# EAGLE design DIY ESP32 SmartClock Kit with Weather Forecasting V1.1 (EAGLE 6.1)
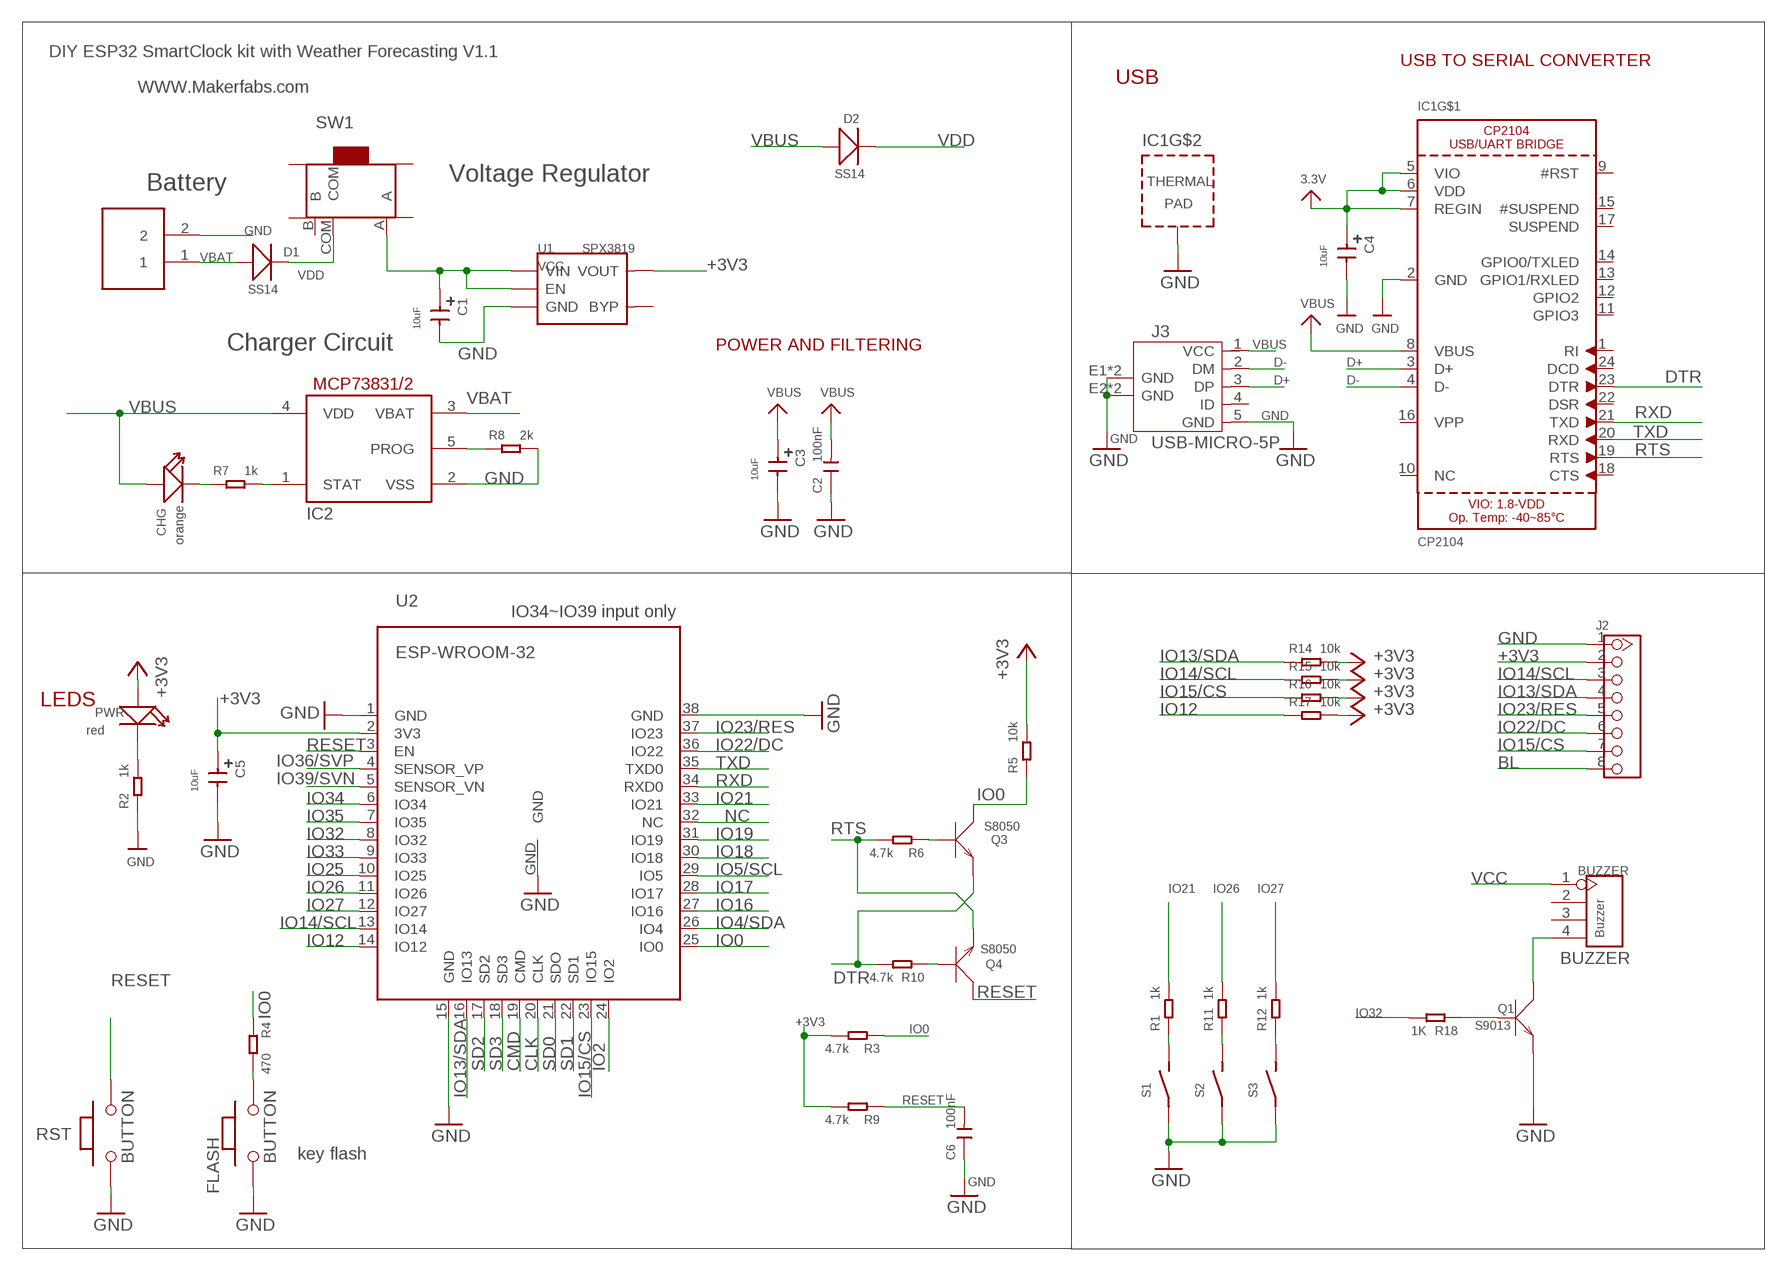
[diagram p0: schematic, sheet 1, part 1 of 2]
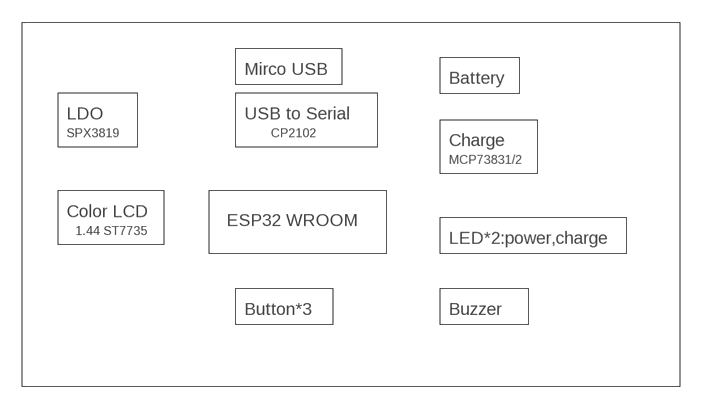
[diagram p1: schematic, sheet 1, part 2 of 2]

## Parts
BUZZER  Buzzer  HEADER-4P-60/35MILROUND  [4P-65/35ROUND]
C1  10uF  C_10U  [CAP_5*7]
C2  100nF  C'5.08'  [CERAMIC-5.08]
C3  10uF  C_10U  [CAP_5*7]
C4  10uF  C_10U  [CAP_5*7]
C5  10uF  C_10U  [CAP_5*7]
C6  100nF  C'5.08'  [CERAMIC-5.08]
CHG  orange  LED'0603'  [LED-0603]
D1  SS14  D'0805'  [SOD323]
D2  SS14  D'0805'  [SOD323]
FLASH  BUTTON  PB157  [157SW]
IC1  CP2104  [QFN24_4MM_SMSC]
IC2  MCP73831/OT  [SOT23-5L]
J1  PH2.0-2P-90-DIP  [PH2.0-2P-90-DIP]
J2  HEADER-8P-2.54  [8P-2.54]
J3  USB-MICRO-5P  [MICRO-USB-5P]
PWR  red  LED'0603'  [LED-0603]
Q1  S9013  TRANSISTOR-NPN-SOT23  [SOT23]
Q3  S8050  TRANSISTOR-NPN-SOT23  [SOT23]
Q4  S8050  TRANSISTOR-NPN-SOT23  [SOT23]
R1  1k  R-0204/7  [0204/7]
R2  1k  R-0204/7  [0204/7]
R3  4.7k  R-0204/7  [0204/7]
R4  470  R-0204/7  [0204/7]
R5  10k  R-0204/7  [0204/7]
R6  4.7k  R-0204/7  [0204/7]
R7  1k  R-0204/7  [0204/7]
R8  2k  R-0204/7  [0204/7]
R9  4.7k  R-0204/7  [0204/7]
R10  4.7k  R-0204/7  [0204/7]
R11  1k  R-0204/7  [0204/7]
R12  1k  R-0204/7  [0204/7]
R14  10k  R-0204/7  [0204/7]
R15  10k  R-0204/7  [0204/7]
R16  10k  R-0204/7  [0204/7]
R17  10k  R-0204/7  [0204/7]
R18  1K  R-0204/7  [0204/7]
RST  BUTTON  PB157  [157SW]
S1  BUTTON_4.54.5  [3*3_BUTTOM_DIP]
S2  BUTTON_4.54.5  [3*3_BUTTOM_DIP]
S3  BUTTON_4.54.5  [3*3_BUTTOM_DIP]
SW1  SWITCH-3P-SMD-6.6X2.8  [3P-SMD-2CH-6.6X2.8-REINFORCE]
U1  SPX3819  [SOT23-5]
U2  ESP-WROOM-32  [ESP-WROOM-32]

## Nets
+3V3: C4.P$1 C5.P$1 IC1.5(VIO) IC1.6(VDD) IC1.7(REGIN) J2.2 PWR.+ R3.2 R5.2 R9.2 R14.2 R15.2 R16.2 R17.2 U1.5(VOUT) U2.2(3V3) ; supply symbol labelled 3.3V
BL: J2.8
CLK: U2.20(CLK)
CMD: U2.19(CMD)
D+: IC1.3(D+) J3.3(DP)
D-: IC1.4(D-) J3.2(DM)
DTR: IC1.23(DTR) Q3.2(E) R10.2
GND: C1.P$2 C2.1 C3.P$2 C4.P$2 C5.P$2 C6.1 FLASH.1 IC1.2(GND) IC1.THERM(TP) IC2.2(VSS) J1.2 J2.1 J3.5(GND) J3.E1(GND) J3.E2(GND) J3.P1(GND) J3.P2(GND) Q1.2(E) R2.1 R8.2 RST.1 S1.1 S1.2 S2.1 S2.2 S3.1 S3.2 U1.2(GND) U2.1(GND) U2.15(GND) U2.38(GND) U2.GND
IO0: Q3.3(C) R3.1 R4.1 R5.1 U2.25(IO0)
IO2: U2.24(IO2)
IO4/SDA: U2.26(IO4)
IO5/SCL: U2.29(IO5)
IO12: R17.1 U2.14(IO12)
IO13/SDA: J2.4 R14.1 U2.16(IO13)
IO14/SCL: J2.3 R15.1 U2.13(IO14)
IO15/CS: J2.7 R16.1 U2.23(IO15)
IO16: U2.27(IO16)
IO17: U2.28(IO17)
IO18: U2.30(IO18)
IO19: U2.31(IO19)
IO21: R1.2 U2.33(IO21)
IO22/DC: J2.6 U2.36(IO22)
IO23/RES: J2.5 U2.37(IO23)
IO25: U2.10(IO25)
IO26: R11.2 U2.11(IO26)
IO27: R12.2 U2.12(IO27)
IO32: R18.2 U2.8(IO32)
IO33: U2.9(IO33)
IO34: U2.6(IO34)
IO35: U2.7(IO35)
IO36/SVP: U2.4(SENSOR_VP)
IO39/SVN: U2.5(SENSOR_VN)
N$1: R11.1 S2.3 S2.4
N$2: BUZZER.4 Q1.3(C)
N$3: R12.1 S3.3 S3.4
N$4: FLASH.2 R4.2
N$5: PWR.- R2.2
N$13: Q4.1(B) R10.1
N$14: Q3.1(B) R6.1
N$15: R1.1 S1.3 S1.4
N$24: Q1.1(B) R18.1
N$25: CHG.- R7.1
N$26: IC2.1(STAT) R7.2
N$31: IC2.5(PROG) R8.1
NC: U2.32(NC)
RESET: C6.2 Q4.3(C) R9.1 RST.2 U2.3(EN)
RTS: IC1.19(RTS) Q4.2(E) R6.2
RXD: IC1.21(TXD) U2.34(RXD0)
SD0: U2.21(SDO)
SD1: U2.22(SD1)
SD2: U2.17(SD2)
SD3: U2.18(SD3)
TXD: IC1.20(RXD) U2.35(TXD0)
VBAT: D1.+ IC2.3(VBAT) J1.1
VBUS: C2.2 C3.P$1 CHG.+ D2.+ IC1.8(VBUS) IC2.4(VDD) J3.1(VCC)
VCC: BUZZER.1 C1.P$1 SW1.A U1.1(VIN) U1.3(EN)
VDD: D1.- D2.- SW1.COM
Unconnected: BUZZER.2 BUZZER.3 IC1.1(RI) IC1.9(#RST) IC1.10(NC) IC1.11(GPIO3) IC1.12(GPIO2) IC1.13(GPIO1/RXLED) IC1.14(GPIO0/TXLED) IC1.15(#SUSPEND) IC1.16(VPP) IC1.17(SUSPEND) IC1.18(CTS) IC1.22(DSR) IC1.24(DCD) J3.4(ID) SW1.B SW1.SS1 SW1.SS2 SW1.SS3 SW1.SS4 U1.4(BYP)

## Notes on the sheet
- DIY ESP32 SmartClock kit with Weather Forecasting V1.1
- USB TO SERIAL CONVERTER
- USB
- WWW.Makerfabs.com
- Voltage Regulator
- Battery
- Mirco USB
- Battery
- Charger Circuit | POWER AND FILTERING | LDO | USB to Serial
- SPX3819 | CP2102
- Charge
- MCP73831/2
- Color LCD
- ESP32 WROOM
- 1.44 ST7735
- LED*2:power,charge
- Button*3 | Buzzer
- IO34~IO39 input only
- LEDS
- BUZZER
- key flash

## Library data of the parts
BUZZER = Connector:HEADER-4P
C1 C3-C5 = 1mytest:C_10U
C2 C6 = Discrete:C*: Ceramic Capacitors
CHG PWR = Discrete:LED*
D1 D2 = Discrete:D*
FLASH RST = MySMD:PB157
IC1 = microbuilder:CP2104: CP2104 - USB to UART Bridge VDD Output: 3.45V
IC2 = adafruit:MCP73831: MCP73831/2 Miniature Single-Cell, Fully Integrated Li-Ion, Li-Polymer Charge Management Controllers. Nice and small simple lipoly charge controller, with adjustable current and status output (LED) http://www.ladyada.net/library/pcb/eaglelibrary.html
J1 = Connector:PH2.0-2P-90-DIP
J2 = Connector:HEADER-8P
J3 = Connector:USB-MICRO-5P
Q1 Q3 Q4 = Discrete:TRANSISTOR-NPN*: NPN audion
R1-R12 R14-R18 = Discrete:R*
S1-S3 = 1mytest:BUTTON_4.5*4.5
SW1 = Discrete:SWITCH-3P-SMD
U1 = IC:SPX3819
U2 = esp32:ESP-WROOM-32

## Net classes
0 default: width 0.203 mm, drill 0.305 mm, clearance 0.152 mm
1 gnd: width 0.635 mm, drill 0.635 mm, clearance 0.254 mm
2 vcc: width 0.406 mm, drill 0.406 mm, clearance 0.254 mm

## Board
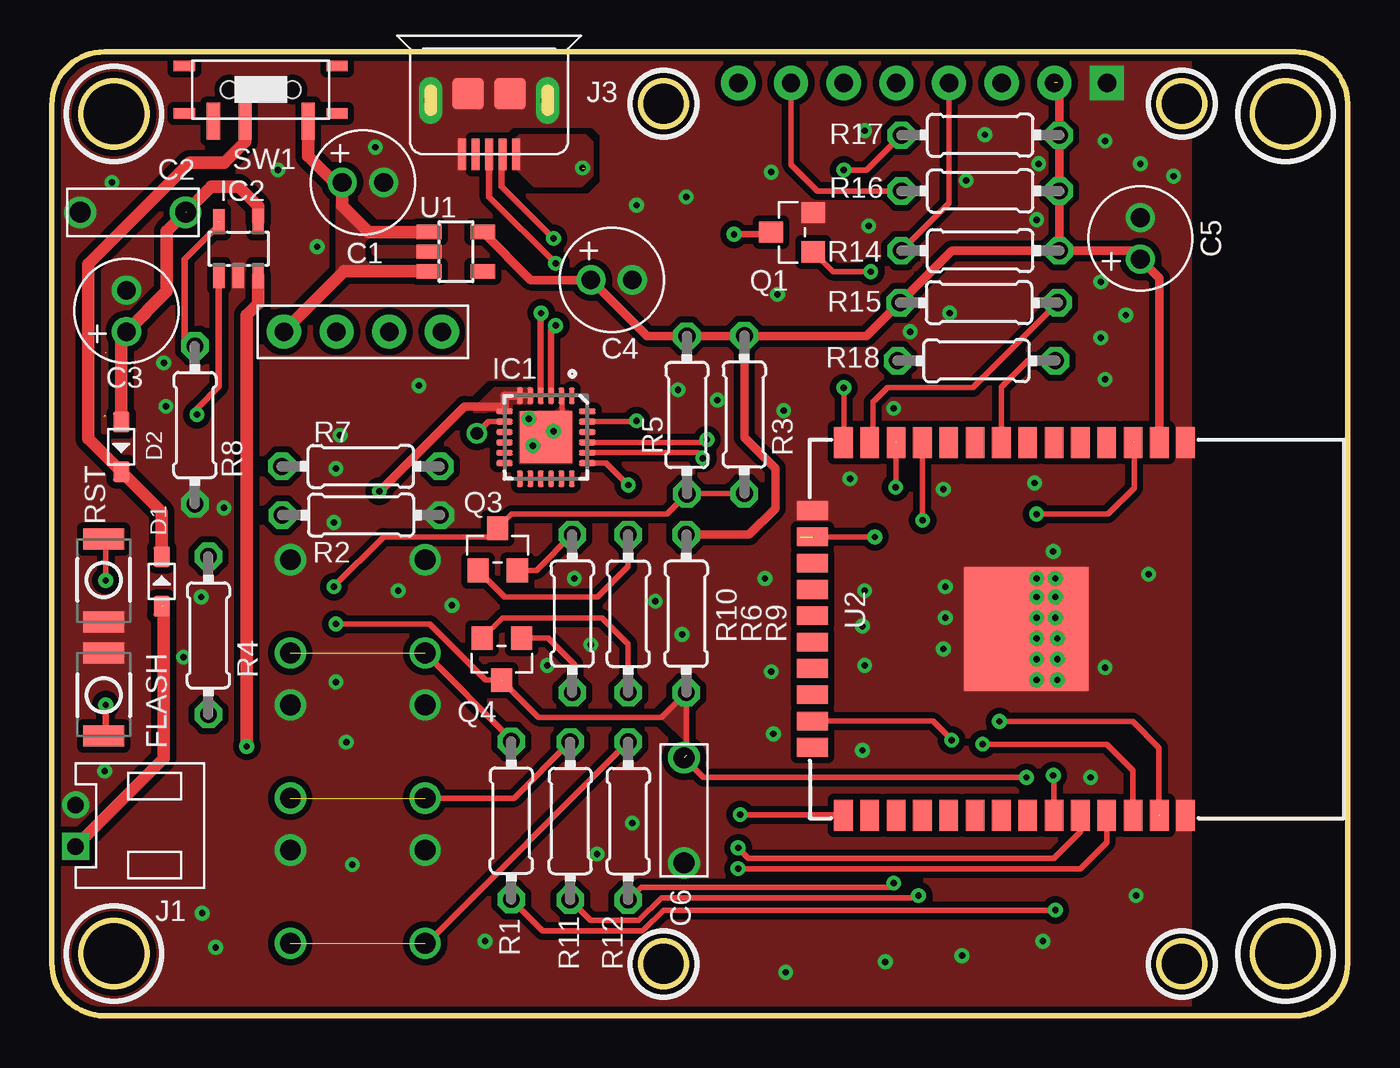
[diagram p2: board, top side]
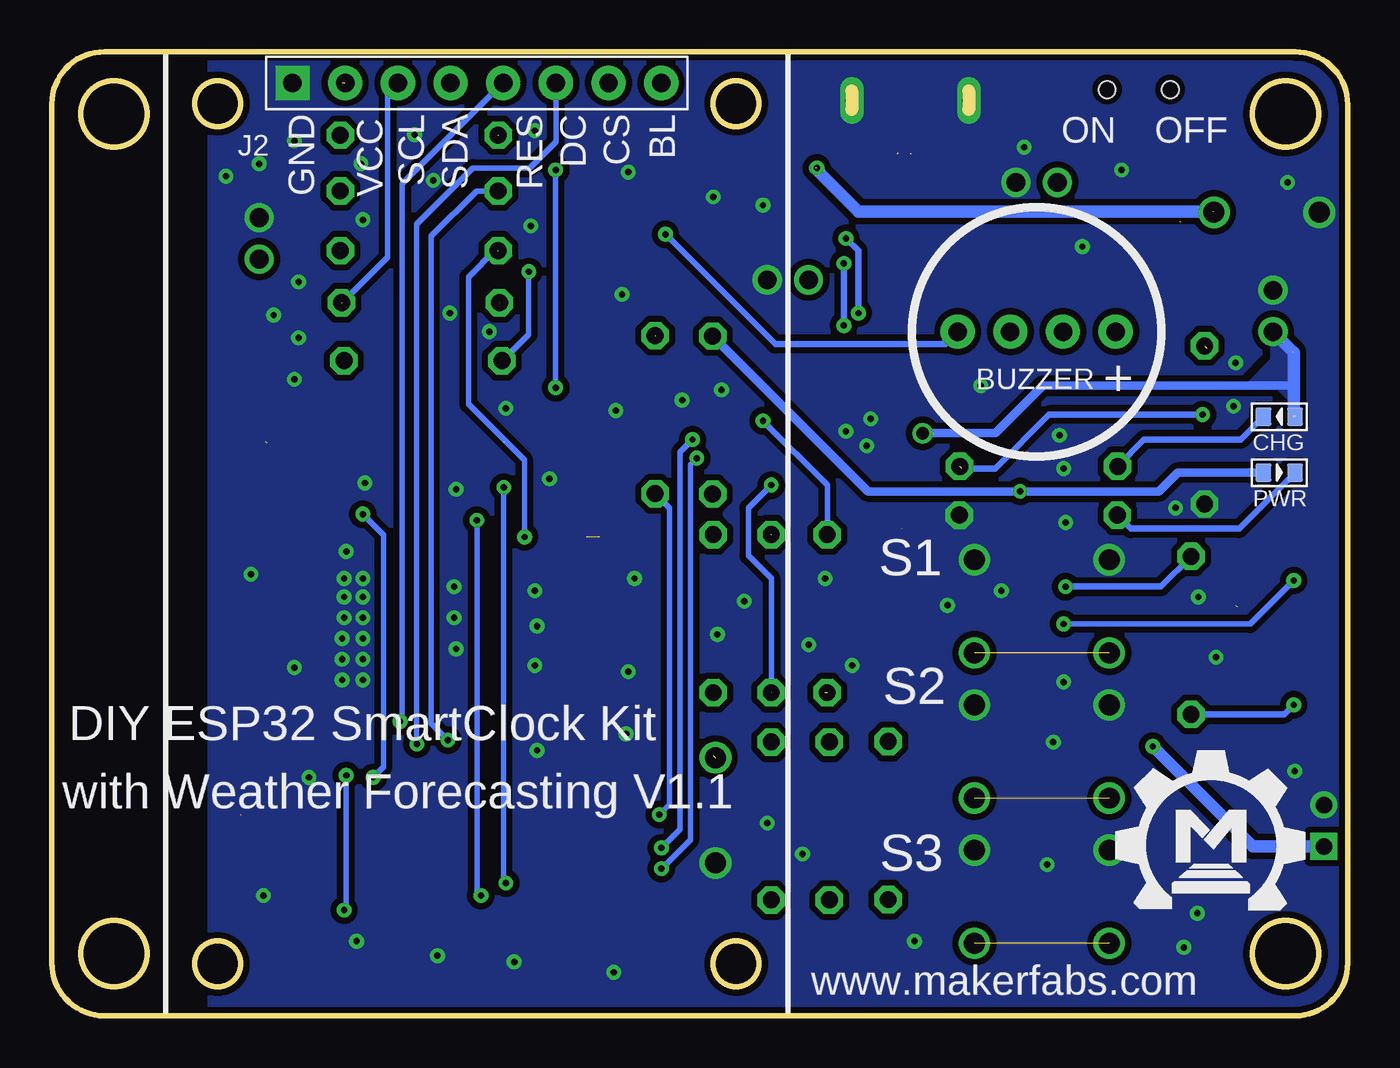
[diagram p3: board, bottom side, seen from below]

Size 62.5 x 46.5 mm. Coordinates in mm from the lower left corner, seen from the top.
Outline: 62.5,2.54 arc-90 59.96,0 2.54,0 arc-90 0,2.54 0,43.96 arc-90 2.54,46.5 59.96,46.5 arc-90 62.5,44 62.5,2.5
Outline: circle at 29.5,2.5 radius 1.1
Outline: circle at 54.5,2.5 radius 1.1
Outline: circle at 29.5,44 radius 1.1
Outline: circle at 54.5,44 radius 1.1
Outline: circle at 3,3 radius 1.6
Outline: circle at 3,43.5 radius 1.6
Outline: circle at 59.5,43.5 radius 1.6
Outline: circle at 59.5,3 radius 1.6
Copper layers (1*16): Top 0.035mm / dielectric 1.5mm / Bottom 0.035mm
Design rules: minimum track width 10mil, minimum drill 24mil, track to track 8mil, track to pad 8mil, pad to pad 8mil, via to via 8mil, smd to smd 8mil, copper to edge 10mil, drill to drill 8mil, minimum pad ring 10mil, minimum via ring 8mil, stop-mask expansion 4mil, vias tented up to drill 100mil, thermal gap 0mil
tRestrict: area 55.3,0 to 63.3,47.1
bRestrict: area 55.3,0 to 63.3,47.1

### Footprints (pad centres in the part's own frame; a part is rotated, then mirrored left to right if it is on the bottom)
4P-65/35ROUND = drill 0.889 pad 1.651: 1 0,3.81; 2 0,1.27; 3 0,-1.27; 4 0,-3.81
CAP_5*7 = drill 0.9: P$1 -1,0; P$2 1,0
CERAMIC-5.08 = drill 1.016: 1 -2.54,0; 2 2.54,0
LED-0603 = smd 0.762 x 0.889: + -0.762,0; - 0.762,0
SOD323 = smd 1 x 0.8: + -1.2,0; - 1.2,0
157SW = smd 1.016 x 1.981: 1 0,0; 2 4,0
QFN24_4MM_SMSC = smd 0.8 x 0.28: 1 -2,1.25; 2 -2,0.75; 3 -2,0.25; 4 -2,-0.25; 5 -2,-0.75; 6 -2,-1.25; 13 2,-1.25; 14 2,-0.75; 15 2,-0.25; 16 2,0.25; 17 2,0.75; 18 2,1.25 | smd 0.28 x 0.8: 7 -1.25,-2; 8 -0.75,-2; 9 -0.25,-2; 10 0.25,-2; 11 0.75,-2; 12 1.25,-2; 19 1.25,2; 20 0.75,2; 21 0.25,2; 22 -0.25,2; 23 -0.75,2; 24 -1.25,2 | smd 2.5 x 2.5: THERM 0,0
SOT23-5L = smd 0.55 x 1.2: 1 -0.95,-1.3; 2 0,-1.3; 3 0.95,-1.3; 4 0.95,1.3; 5 -0.95,1.3
PH2.0-2P-90-DIP = drill 0.8 square: 1 0,1 | drill 0.8: 2 0,-1
8P-2.54 = drill 0.889 pad 1.651 square: 1 0,8.89 | drill 0.889 pad 1.651: 2 0,6.35; 3 0,3.81; 4 0,1.27; 5 0,-1.27; 6 0,-3.81; 7 0,-6.35; 8 0,-8.89
MICRO-USB-5P = smd 0.38 x 1.52: 1 -1.3,0; 2 -0.65,0; 3 0,0; 4 0.65,0; 5 1.3,0 | smd 1.524 x 1.524: E1 -1.016,-2.921; E2 1.016,-2.921 | drill 0.635 pad 1.143 long: P1 -2.819,-2.591; P2 2.819,-2.591
SOT23 = smd 1.016 x 1.143: 1 -0.95,-1.016; 2 0.95,-1.016; 3 0,1.016
0204/7 = drill 0.813 octagon: 1 -3.81,0; 2 3.81,0
3*3_BUTTOM_DIP = drill 1: 1 0,4.5; 2 6.5,4.5; 3 0,0; 4 6.5,0
3P-SMD-2CH-6.6X2.8-REINFORCE = smd 1.778 x 0.635: A 1.524,2.286; B 1.524,-2.286; COM 1.524,-0.762 | smd 0.508 x 1.016: SS1 -1.143,-3.683; SS2 1.143,-3.683; SS3 1.143,3.683; SS4 -1.143,3.683 | hole 0.813: 0,-1.524; 0,1.524
SOT23-5 = smd 0.69 x 1.2: 1 -0.95,-1.3; 2 0,-1.3; 3 0.95,-1.3; 4 0.95,1.3; 5 -0.95,1.3
ESP-WROOM-32 = smd 0.9 x 1.5: 1 7.7,9; 2 6.43,9; 3 5.16,9; 4 3.89,9; 5 2.62,9; 6 1.35,9; 7 0.08,9; 8 -1.19,9; 9 -2.46,9; 10 -3.73,9; 11 -5,9; 12 -6.27,9; 13 -7.54,9; 14 -8.81,9; 25 -8.81,-9; 26 -7.54,-9; 27 -6.27,-9; 28 -5,-9; 29 -3.73,-9; 30 -2.46,-9; 31 -1.19,-9; 32 0.08,-9; 33 1.35,-9; 34 2.62,-9; 35 3.89,-9; 36 5.16,-9; 37 6.43,-9; 38 7.7,-9 | smd 1.5 x 0.9: 15 -10.3,5.715; 16 -10.3,4.445; 17 -10.3,3.175; 18 -10.3,1.905; 19 -10.3,0.635; 20 -10.3,-0.635; 21 -10.3,-1.905; 22 -10.3,-3.175; 23 -10.3,-4.445; 24 -10.3,-5.715 | smd 6 x 6: GND 0,0

### Placement (x,y rotation side)
BUZZER  15,33 90 top
C1  15,40.2 0 top
C2  3.91,38.76 0 top
C3  3.6,34 90 top
C4  27,35.5 0 top
C5  52.5,37.5 90 top
C6  30.49,9.91 90 top
CHG  3.3,28.9 180 bottom
D1  5.3,20.95 90 top
D2  3.35,27.45 270 top
FLASH  2.5,17.5 270 top
IC1  23.83,27.91 270 top
IC2  9,37 0 top
J1  1.15,9.17 180 top
J2  42,45 90 bottom
J3  21.09,41.56 180 top
PWR  3.3,26.2 0 bottom
Q1  35.7,37.8 90 top
Q3  21.5,22.5 0 top
Q4  21.7,17.2 180 top
R1  22.16,9.42 270 top
R2  14.92,24.15 180 top
R3  33.4,29 90 top
R4  7.55,18.35 270 top
R5  30.63,28.98 90 top
R6  27.8,19.4 270 top
R7  14.9,26.5 0 top
R8  6.9,28.5 270 top
R9  30.6,19.4 90 top
R10  25.1,19.4 90 top
R11  25,9.4 270 top
R12  27.8,9.4 270 top
R14  44.78,36.91 0 top
R15  44.72,34.4 180 top
R16  44.78,39.79 0 top
R17  44.78,42.48 0 top
R18  44.6,31.6 0 top
RST  2.5,19 90 top
S1  11.5,17.5 0 top
S2  11.5,10.5 0 top
S3  11.5,3.5 0 top
SW1  10.08,44.68 270 top
U1  19.49,36.86 270 top
U2  46.99,18.66 0 top
U$1  [MAKERFABS_0.3]  10.71,5.16 0 bottom

### Tracks (layer width: path | path; a pad name or v marks a point on that pad's centre or on a via)
+3V3  (via drill 0.3)  (4 unrouted)
  Top 0.254: IC1.5 IC1.6
  Top 0.406: U1.5 23.1,35.5 C4.P$1 28.71,32.79 R5.2 33.39,32.79 R3.2 | IC1.6 21.83,29.91 IC1.7 | R3.2 39.3,32.8 R15.2 | R15.2 43.41,36.9 R14.2 | R9.2 33.63,23.21 34.9,24.48 34.9,26.4 33.4,27.9 R3.2 | U2.2 53.42,35.58 C5.P$1 52.09,36.91 R14.2 R16.2 R17.2 48.59,44.91 48.5,45 | v15.8,25.3 19.9,29.4 21.8,29.4
  Bottom 0.305: 4.7,26.2 4.69,26.2
  Bottom 0.406: R5.2 23.14,25.3 v15.8,25.3 9.1,25.3 8.2,26.2 4.7,26.2 PWR.+ | PWR.+
  pour Top (isolate 0.305, no thermals): 22.1,29.2 20.4,29.2 21.4,30.2 23.1,30.2 23.1,29.6 22.1,29.6
D+  (via drill 0.3)  (1 unrouted)
  Top 0.305: IC1.3 24.08,33.08 v24.3,33.3 | v24.3,36.3 21.1,39.5 21.1,41.6
  Bottom 0.305: v24.3,33.3 v24.3,36.3
D-  (via drill 0.3)  (1 unrouted)
  Top 0.254: IC1.4 23.6,29.93
  Top 0.305: IC1.4 23.58,33.88 arc-90 v23.6,33.9 | v24.2,37.5 21.7,40 21.7,41.6
  Bottom 0.305: v23.6,33.9 23.6,36.9 v24.2,37.5
DTR  (via drill 0.3)
  Top 0.254: Q3.2 23.37,21.48 R10.2 | IC1.23 28.16,28.66 v28.2,28.7
  Bottom 0.254: R10.2 25.1,25.6 v28.2,28.7
GND  (via drill 0.3)
  Top 0.254: IC1.2 24.6,29.91 24.6,28.9
  other vias: 23,28.8 17.7,30.4 13.9,28 6.35,17.3 13.7,16.1 16.7,20.5 14.2,13.2 14.5,7.3 7.9,3.3 20.9,3.6 35.4,2.1 43.9,2.9 47.8,3.6 34.8,13.6 34.7,16.6 34.4,21.1 39.2,16.9 43.1,20.7 48.4,19.2 48.3,22.4 47.4,25.7 43,25.4 35.3,29.2 50.6,35.4 52.5,41.1 50.8,42.2 54.1,40.5 34.7,40.7 32.1,29.7 30.2,30.2 30.4,18.4 29.1,20 25.2,21.1 44.1,40.3 23.9,16.9 12.8,37.1 40.2,2.6 24.2,28.2 23.2,27.5 43,17.7 50.8,16.8 52.9,21.3 50.1,11.5 52.3,5.8 28,9.3 26.3,7.8 7.25,4.95 26,17.9 30.6,39.5 35,34.8 39.4,38.1 50.8,30.7 51.8,33.8 19.3,19.8 13.6,23.8 40.6,29.3 5.4,31.5 7.2,20.2 8.3,24.5 13.7,26.4 5.5,29.4 45,42.5 47.6,41.1 47.5,38.4 43.3,33.9 50.6,32.7 47.5,20.2 47.5,21.1 48.4,20.2 48.4,21.1 47.5,19.2 47.5,18.2 48.5,18.2 47.5,17.2 48.5,17.2 47.5,16.2 48.5,16.2 39.1,12.8 10.9,40.8 15.6,41.9 2.9,40.2 28.2,39.1 38.5,25.9 43.1,19.2 39.2,20.5 39.1,18.8 39.2,42.7 41.4,33 2.55,11.8
  pour Bottom (isolate 0.305, rank 4, no thermals): -4.5,25.5 -4.5,49.73 -3.23,51 25.5,51 62.73,51 64,49.73 64,23 64,-2.73 62.73,-4 32.5,-4 -3.23,-4 -4.5,-2.73
  pour Top (isolate 0.305, rank 4, no thermals): -4.5,20.5 -4.5,49.73 -3.23,51 23.5,51 62.73,51 64,49.73 64,33.5 64,-3.23 62.73,-4.5 30.5,-4.5 -3.23,-4.5 -4.5,-3.23
IO0  (via drill 0.3)  (2 unrouted)
  Top 0.254: Q3.3 22.18,24.2 29.66,24.2 R5.1 30.65,25.19 R3.1 | v13.6,20.7 16,23.1 21.1,23.1 arc90 21.5,23.5 | v33.2,9.7 38.14,9.7 U2.25
  Bottom 0.254: R3.1 32.7,24.49 32.7,10.2 v33.2,9.7
  Bottom 0.305: v13.6,20.7 9.01,20.7 R4.1
IO12  (via drill 0.3)  (1 unrouted)
  Top 0.254: U2.14 38.2,27.68 v38.2,30.3 | v38.2,40.8 39.3,40.8 41,42.5
  Bottom 0.254: v38.2,30.3 v38.2,40.8
IO13/SDA  (via drill 0.3)  (4 unrouted)
  Top 0.254: 36.09,23.11 36.1,23.1 | v39.7,23.1 | v39.7,23.1 U2.16 | R14.1 43.27,39.21 J2.4
  Bottom 0.254: v39.7,23.1 39.7,26.8 42.4,29.5 42.4,35.64 41.14,36.9 41,36.9
IO14/SCL  (1 unrouted)
  Top 0.254: U2.13 39.6,27.81 39.6,29.6 40.3,30.3 44.43,30.3 R15.1
  Bottom 0.254: J2.3 46.3,44.51 46.3,36.6 48.5,34.4
IO15/CS  (via drill 0.3)
  Top 0.254: U2.23 42.48,14.21 v43.4,13.3 | R16.1 36.92,39.79 35.65,41.06 J2.7
  Bottom 0.254: v43.4,13.3 44.2,14.1 44.2,37.6 42.01,39.79 R16.1
IO21  (via drill 0.3)
  Top 0.254: R1.2 23.67,4.1 28.5,4.1 29.5,5.1 v48.4,5.1 | v48.3,11.6 48.34,11.56 U2.33
  Bottom 0.254: v48.4,5.1 48.3,5.2 v48.3,11.6
IO22/DC  (via drill 0.3)
  Top 0.254: U2.36 52.15,11.83 50.88,13.1 v44.9,13.1 | v44.9,13.1
  Bottom 0.254: v44.9,13.1 44.9,38.2 42.2,40.9 39.46,40.9 38.19,42.17 J2.6
IO23/RES  (via drill 0.3)  (1 unrouted)
  Top 0.254: v45.7,14.2 52.13,14.2 53.4,12.93 53.4,9.7
  Bottom 0.254: J2.5 45.6,40.13 45.6,14.3 v45.7,14.2
IO26  (via drill 0.3)
  Top 0.254: R11.2 25.99,4.6 28.3,4.6 29.4,5.7 41.7,5.7 v41.8,5.8 | v42,23.9 v41.99,23.91 U2.11
  Bottom 0.254: v41.8,5.8 42,6 v42,23.9
IO27  (via drill 0.3)  (1 unrouted)
  Top 0.254: v40.7,25.5 40.7,27.7 | R12.2 28.41,6.2 40.4,6.2 v40.6,6.4
  Bottom 0.254: v40.6,6.4 40.7,6.5 v40.7,25.5
IO32
  Top 0.254: U2.8 45.8,30.33 47.07,31.6 R18.2
N$1  (1 unrouted)
  Top 0.254: S2.4 22.29,10.5 R11.1
N$2  (via drill 0.3)
  Top 0.305: v32.9,37.7 34.58,37.7 Q1.3
  Bottom 0.305: BUZZER.4 19.41,32.4 27.6,32.4 v32.9,37.7
N$3  (2 unrouted)
  Top 0.254: S3.4 18.09,3.5 R12.1
N$4  (via drill 0.3)
  Top 0.305: FLASH.2 2.6,13.6 v2.6,15
  Bottom 0.305: R4.2 3.06,14.54 v2.6,15
N$5
  Bottom 0.305: PWR.- 5.24,23.5 10.46,23.5 R2.2
N$13  (1 unrouted)
  Top 0.254: Q4.1 23.93,18.22 25.2,16.95 25.2,15.6
N$14  (1 unrouted)
  Top 0.254: Q3.1 21.83,20.2 26.33,20.2 27.8,21.67 R6.1
N$15  (1 unrouted)
  Top 0.254: R1.1 22.16,13.34 S1.4
N$24  (via drill 0.3)
  Top 0.254: Q1.1 37.67,35.9 v39.5,35.9
  Bottom 0.254: v39.5,35.9 39.5,32.87 40.77,31.6 R18.1
N$25
  Bottom 0.305: R7.1 11.09,26.53 9.82,27.8 5.16,27.8 CHG.-
N$26  (via drill 0.3)  (1 unrouted)
  Top 0.305: IC2.1 8.05,30.35 7,29.3 v7,29
  Bottom 0.305: v7,29 14.4,29 17,26.4 18.6,26.4
N$31  (2 unrouted)
  Top 0.305: 6.8,32.2 6.4,32.6 6.4,36.5 8.1,38.2 8.1,38.3
RESET  (via drill 0.3)  (4 unrouted)
  Top 0.254: RST.2 2.6,22.9 v2.6,21 | Q4.3 23.48,14.4 29.41,14.4 R9.1 30.6,12.56 | 21.7,16.2 | v13.7,18.9 18.23,18.9 20.93,16.2 21.7,16.2 | C6.2 31.44,11.5 v47,11.5 | v47.5,24.2 50.93,24.2 52.2,25.47 52.2,27.7
  Bottom 0.254: v2.6,21 4.7,18.9 v13.7,18.9 | v47,11.5 46.5,12 46.5,23.2 v47.5,24.2
  pour Top (isolate 0.305, no thermals): 29.5,14.4 30.6,13.3 30.6,15.6 29.5,14.5
RTS  (via drill 0.3)  (1 unrouted)
  Top 0.254: Q4.2 21.73,19.2 26.53,19.2 27.8,17.93 R6.2 | IC1.19 26.74,26.66 v27.8,25.6
  Bottom 0.254: v27.8,25.6 28.9,24.5 28.9,22.2 27.8,21.1 R6.2
RXD  (via drill 0.3)  (1 unrouted)
  Top 0.254: IC1.21 31.46,27.66 v31.6,27.8 | v33.1,8.1 33.6,7.6 48.34,7.6 49.61,8.87 U2.34
  Bottom 0.254: v31.6,27.8 32.2,27.2 32.2,9 | 32.2,9 | 32.2,9 v33.1,8.1
TXD  (via drill 0.3)
  Top 0.254: IC1.20 31.14,27.16 v31.4,26.9 | v33.1,7.1 49.61,7.1 50.88,8.37 U2.35
  Bottom 0.254: v31.4,26.9 31.7,26.6 31.7,8.5 v33.1,7.1
VBAT  (via drill 0.3)  (1 unrouted)
  Top 0.61: J1.1 5.4,12.42 5.4,19.8 | IC2.3 9.95,34.35 9.4,33.8 v9.4,13
  Bottom 0.61: v9.4,13 4.57,8.17 J1.1
VBUS  (via drill 0.3, 0.6)  (5 unrouted)
  Top 0.254: IC1.8 21.06,28.66 v20.5,28.1
  Top 0.61: IC2.4 9.95,39.05 9,40 7.69,40 C2.2 5.55,37.86 5.55,34.95 C3.P$1 3.35,32.75 D2.+
  Bottom 0.406: v20.5,28.1 17,28.1 14.7,30.4 2.6,30.4 2.6,28.9
  Bottom 0.61: 2.61,32.01 C3.P$1 | 6.5,38.8 23.6,38.8 25.7,40.9 | 2.6,32 2.6,29 2.55,28.95
  other vias: 25.6,40.9
  pour Top (isolate 0.305, no thermals): 22.4,41.4 22.4,41 23.3,40.1 25.5,40.1 26,40.6 26,42.1 25.7,42.4 22.6,42.4 22.4,42.2
  pour Bottom (isolate 0.406): 2.65,29.65 3.35,30.35 4.85,30.35 3.6,31.6 3.6,32.95 2.65,32
VCC
  Top 0.61: SW1.A 12.37,41.47 13.64,40.2 C1.P$1 14,39.08 15.27,37.81 U1.1 | U1.3 14.1,35.91 BUZZER.1
  pour Top (isolate 0.305): 13.8,39.1 13.8,35.9 15.3,35.9 15.3,36.1 15,36.4 15,37.4 15.3,37.7 15.3,38 14.2,39.1
VDD
  Top 0.61: D1.- 5.3,24.3 D2.- 1.75,27.85 1.75,36.25 6.65,41.15 8.3,41.15 9.32,42.17 SW1.COM

### Text on the board
bPlace: BL | CS | DC | RES | SDA | SCL | GND | VCC | OFF | ON | + | DIY ESP32 SmartClock Kit | with Weather Forecasting V1.1 | www.makerfabs.com